# EAGLE schematic testbench (EAGLE 6.6.0)
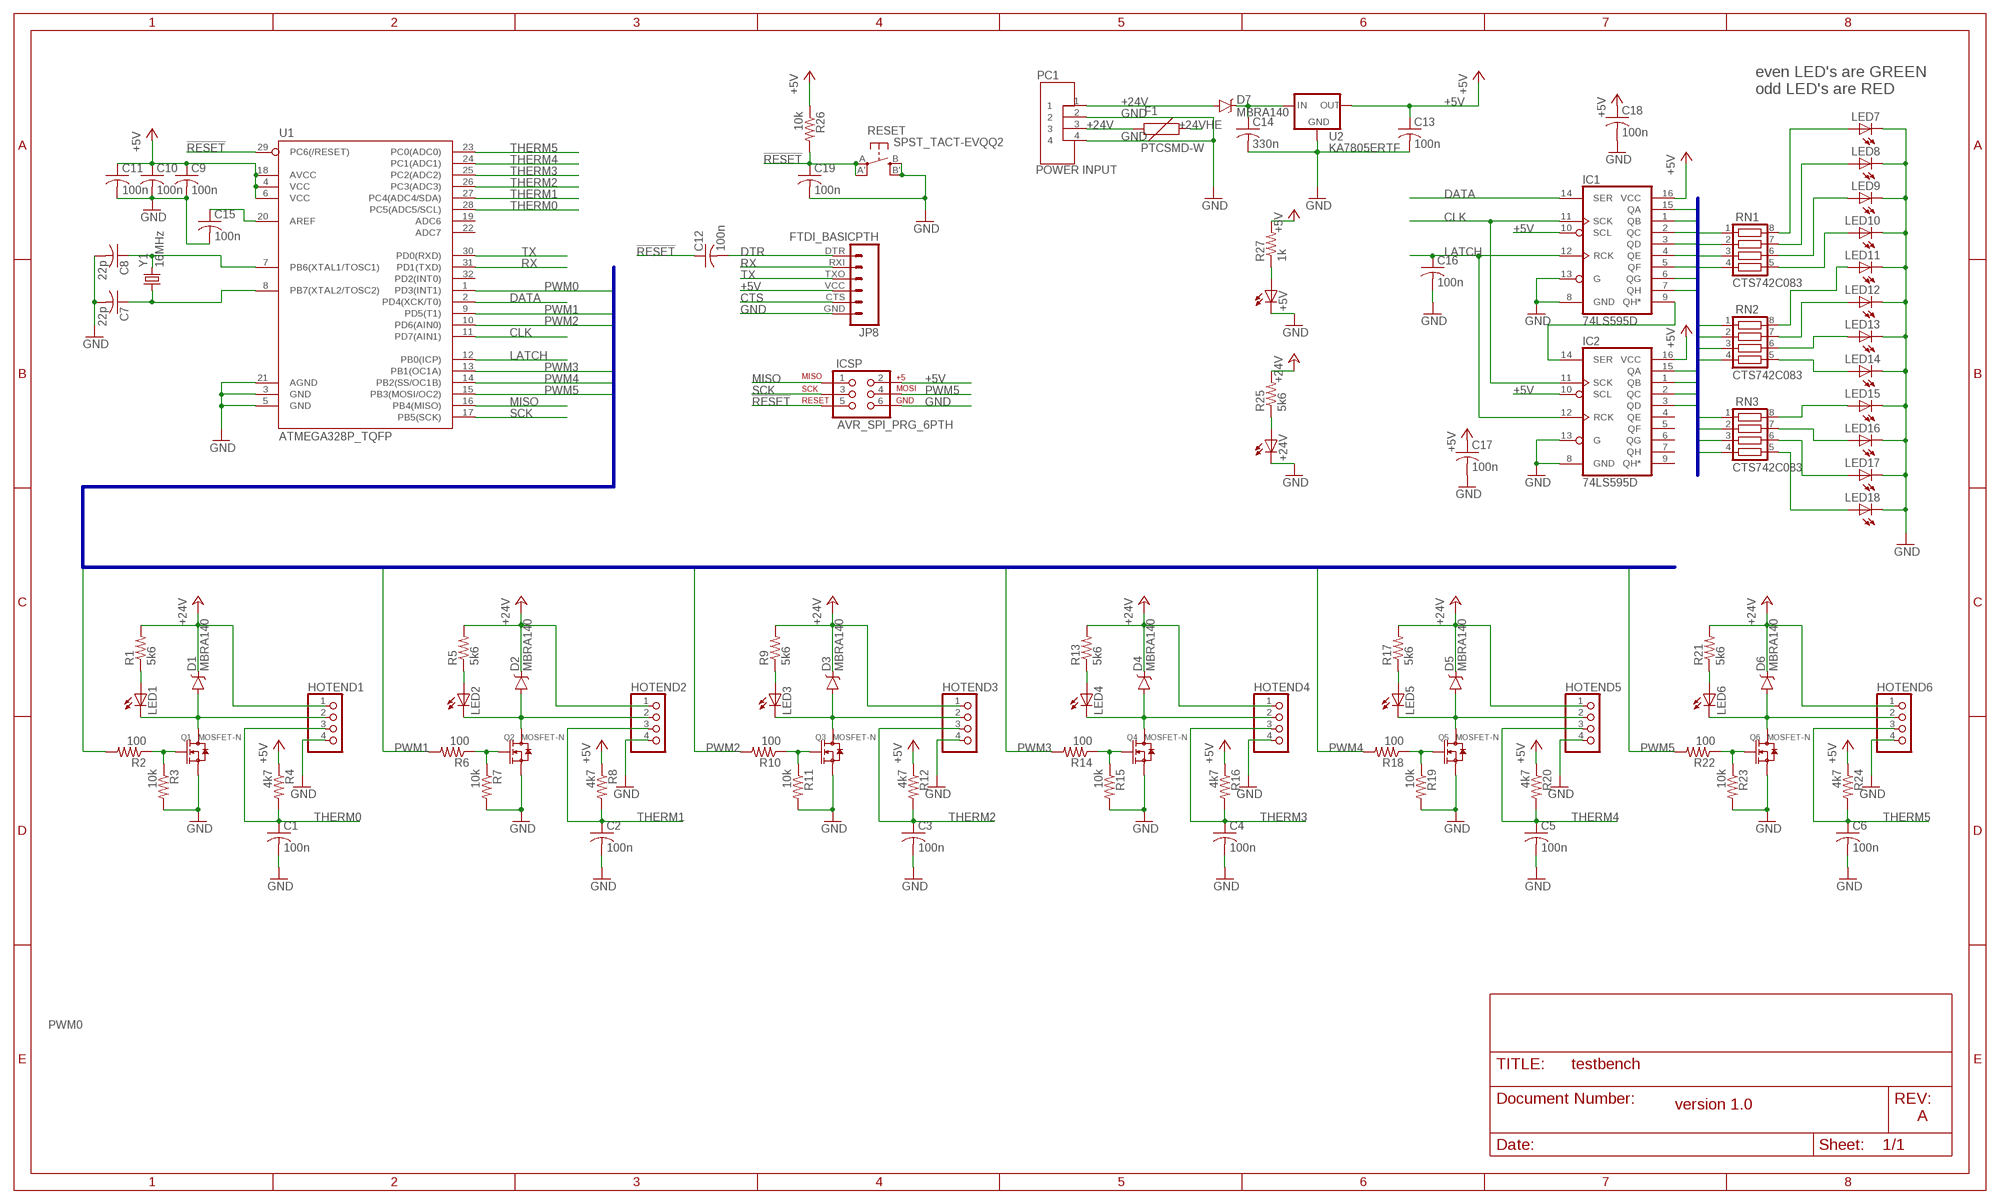
[diagram p0: schematic, sheet 1]

## Parts
+5V  LEDCHIP-LED0805  [CHIP-LED0805]
+24V  LEDCHIP-LED0805  [CHIP-LED0805]
C1  100n  C-USC0805K  [C0805K]
C2  100n  C-USC0805K  [C0805K]
C3  100n  C-USC0805K  [C0805K]
C4  100n  C-USC0805K  [C0805K]
C5  100n  C-USC0805K  [C0805K]
C6  100n  C-USC0805K  [C0805K]
C7  22p  C-USC0805K  [C0805K]
C8  22p  C-USC0805K  [C0805K]
C9  100n  C-USC0805K  [C0805K]
C10  100n  C-USC0805K  [C0805K]
C11  100n  C-USC0805K  [C0805K]
C12  100n  C-USC0805K  [C0805K]
C13  100n  C-USC0805K  [C0805K]
C14  330n  C-USC0805K  [C0805K]
C15  100n  C-USC0805K  [C0805K]
C16  100n  C-USC0805K  [C0805K]
C17  100n  C-USC0805K  [C0805K]
C18  100n  C-USC0805K  [C0805K]
C19  100n  C-USC0805K  [C0805K]
D1  MBRA140  [SMA-DIODE]
D2  MBRA140  [SMA-DIODE]
D3  MBRA140  [SMA-DIODE]
D4  MBRA140  [SMA-DIODE]
D5  MBRA140  [SMA-DIODE]
D6  MBRA140  [SMA-DIODE]
D7  MBRA140  [SMA-DIODE]
F1  PTCSMD-W  [PTC-1206-WIDE]
HOTEND1  PINHD-1X4  [1X04]
HOTEND2  PINHD-1X4  [1X04]
HOTEND3  PINHD-1X4  [1X04]
HOTEND4  PINHD-1X4  [1X04]
HOTEND5  PINHD-1X4  [1X04]
HOTEND6  PINHD-1X4  [1X04]
IC1  74LS595D  [SO16]
IC2  74LS595D  [SO16]
ICSP  AVR_SPI_PRG_6PTH  [2X3]
JP8  FTDI_BASICPTH  [FTDI_BASIC]
LED1  LEDCHIP-LED0805  [CHIP-LED0805]
LED2  LEDCHIP-LED0805  [CHIP-LED0805]
LED3  LEDCHIP-LED0805  [CHIP-LED0805]
LED4  LEDCHIP-LED0805  [CHIP-LED0805]
LED5  LEDCHIP-LED0805  [CHIP-LED0805]
LED6  LEDCHIP-LED0805  [CHIP-LED0805]
LED7  LEDCHIP-LED0805  [CHIP-LED0805]
LED8  LEDCHIP-LED0805  [CHIP-LED0805]
LED9  LEDCHIP-LED0805  [CHIP-LED0805]
LED10  LEDCHIP-LED0805  [CHIP-LED0805]
LED11  LEDCHIP-LED0805  [CHIP-LED0805]
LED12  LEDCHIP-LED0805  [CHIP-LED0805]
LED13  LEDCHIP-LED0805  [CHIP-LED0805]
LED14  LEDCHIP-LED0805  [CHIP-LED0805]
LED15  LEDCHIP-LED0805  [CHIP-LED0805]
LED16  LEDCHIP-LED0805  [CHIP-LED0805]
LED17  LEDCHIP-LED0805  [CHIP-LED0805]
LED18  LEDCHIP-LED0805  [CHIP-LED0805]
PC1  POWER INPUT  POWER_CONNECTOR_4WAY  [MOLEX_MINIFIT-JR]
Q1  MOSFET-N  [SOIC8]
Q2  MOSFET-N  [SOIC8]
Q3  MOSFET-N  [SOIC8]
Q4  MOSFET-N  [SOIC8]
Q5  MOSFET-N  [SOIC8]
Q6  MOSFET-N  [SOIC8]
R1  5k6  R-US_R0805  [R0805]
R2  100  R-US_R0805  [R0805]
R3  10k  R-US_R0805  [R0805]
R4  4k7  R-US_R0805  [R0805]
R5  5k6  R-US_R0805  [R0805]
R6  100  R-US_R0805  [R0805]
R7  10k  R-US_R0805  [R0805]
R8  4k7  R-US_R0805  [R0805]
R9  5k6  R-US_R0805  [R0805]
R10  100  R-US_R0805  [R0805]
R11  10k  R-US_R0805  [R0805]
R12  4k7  R-US_R0805  [R0805]
R13  5k6  R-US_R0805  [R0805]
R14  100  R-US_R0805  [R0805]
R15  10k  R-US_R0805  [R0805]
R16  4k7  R-US_R0805  [R0805]
R17  5k6  R-US_R0805  [R0805]
R18  100  R-US_R0805  [R0805]
R19  10k  R-US_R0805  [R0805]
R20  4k7  R-US_R0805  [R0805]
R21  5k6  R-US_R0805  [R0805]
R22  100  R-US_R0805  [R0805]
R23  10k  R-US_R0805  [R0805]
R24  4k7  R-US_R0805  [R0805]
R25  5k6  R-US_R0805  [R0805]
R26  10k  R-US_R0805  [R0805]
R27  1k  R-US_R0805  [R0805]
RESET  SPST_TACT-EVQQ2  [EVQ-Q2]
RN1  CTS742C083  [CTS742C083]
RN2  CTS742C083  [CTS742C083]
RN3  CTS742C083  [CTS742C083]
U1  ATMEGA328P_TQFP  [TQFP32-08]
U2  KA7805ERTF  V_REG_78XX7812  [TO-252]
Y1  16MHz  CRYSTALHC49US  [HC49US]

## Nets
!RESET: C12.1 C19.1 ICSP.5 R26.2 RESET.A'(P1) RESET.A(P) U1.29(PC6(/RESET))
+5V: C9.1 C10.1 C11.1 C13.1 C17.1 C18.1 IC1.10(SCL) IC1.16(VCC) IC2.10(SCL) IC2.16(VCC) ICSP.2 JP8.VCC R4.1 R8.1 R12.1 R16.1 R20.1 R24.1 R26.1 R27.2 U1.4(VCC) U1.6(VCC) U1.18(AVCC) U2.2(OUT)
+24V: D7.A F1.1 PC1.1 PC1.3 R25.2
+24VHE: D1.C D2.C D3.C D4.C D5.C D6.C F1.2 HOTEND1.1 HOTEND2.1 HOTEND3.1 HOTEND4.1 HOTEND5.1 HOTEND6.1 R1.2 R5.2 R9.2 R13.2 R17.2 R21.2 ; supply symbol labelled +24V
CLK: IC1.11(SCK) IC2.11(SCK) U1.11(PD7(AIN1))
CTS: JP8.CTS
DATA: IC1.14(SER) U1.2(PD4(XCK/T0))
DTR: C12.2 JP8.DTR
GND: +5V.C +24V.C C1.2 C2.2 C3.2 C4.2 C5.2 C6.2 C7.2 C8.2 C9.2 C10.2 C11.2 C13.2 C14.2 C15.2 C16.2 C17.2 C18.2 C19.2 HOTEND1.4 HOTEND2.4 HOTEND3.4 HOTEND4.4 HOTEND5.4 HOTEND6.4 IC1.8(GND) IC1.13(G) IC2.8(GND) IC2.13(G) ICSP.6 JP8.GND LED7.C LED8.C LED9.C LED10.C LED11.C LED12.C LED13.C LED14.C LED15.C LED16.C LED17.C LED18.C PC1.2 PC1.4 Q1.1(S) Q1.2(S) Q1.3(S) Q2.1(S) Q2.2(S) Q2.3(S) Q3.1(S) Q3.2(S) Q3.3(S) Q4.1(S) Q4.2(S) Q4.3(S) Q5.1(S) Q5.2(S) Q5.3(S) Q6.1(S) Q6.2(S) Q6.3(S) R3.2 R7.2 R11.2 R15.2 R19.2 R23.2 RESET.B'(S1) RESET.B(S) U1.3(GND) U1.5(GND) U1.21(AGND) U2.3(GND)
H1: D1.A HOTEND1.2 LED1.C Q1.5(D) Q1.6(D) Q1.7(D) Q1.8(D)
H2: D2.A HOTEND2.2 LED2.C Q2.5(D) Q2.6(D) Q2.7(D) Q2.8(D)
H3: D3.A HOTEND3.2 LED3.C Q3.5(D) Q3.6(D) Q3.7(D) Q3.8(D)
H4: D4.A HOTEND4.2 LED4.C Q4.5(D) Q4.6(D) Q4.7(D) Q4.8(D)
H5: D5.A HOTEND5.2 LED5.C Q5.5(D) Q5.6(D) Q5.7(D) Q5.8(D)
H6: D6.A HOTEND6.2 LED6.C Q6.5(D) Q6.6(D) Q6.7(D) Q6.8(D)
LATCH: C16.1 IC1.12(RCK) IC2.12(RCK) U1.12(PB0(ICP))
LED0: IC1.15(QA) RN2.4
LED1: IC1.1(QB) RN2.3
LED2: IC1.2(QC) RN2.2
LED3: IC1.3(QD) RN2.1
LED4: IC1.4(QE) RN1.4
LED5: IC1.5(QF) RN1.3
LED6: IC1.6(QG) RN1.2
LED7: IC1.7(QH) RN1.1
LED8: IC2.15(QA) RN3.4
LED9: IC2.1(QB) RN3.3
LED10: IC2.2(QC) RN3.2
LED11: IC2.3(QD) RN3.1
MISO: ICSP.1 U1.16(PB4(MISO))
N$1: Q1.4(G) R2.1 R3.1
N$2: +24V.A R25.1
N$3: LED1.A R1.1
N$4: Q5.4(G) R18.1 R19.1
N$5: C7.1 U1.8(PB7(XTAL2/TOSC2)) Y1.1
N$6: LED7.A RN1.8
N$8: Q2.4(G) R6.1 R7.1
N$10: LED2.A R5.1
N$11: Q3.4(G) R10.1 R11.1
N$13: LED3.A R9.1
N$14: Q4.4(G) R14.1 R15.1
N$16: LED4.A R13.1
N$17: LED5.A R17.1
N$18: Q6.4(G) R22.1 R23.1
N$20: LED6.A R21.1
N$21: C8.1 U1.7(PB6(XTAL1/TOSC1)) Y1.2
N$22: C15.1 U1.20(AREF)
N$23: C14.1 D7.C U2.1(IN)
N$24: LED8.A RN1.7
N$25: LED9.A RN1.6
N$26: LED10.A RN1.5
N$27: LED11.A RN2.8
N$28: LED12.A RN2.7
N$29: LED13.A RN2.6
N$30: LED14.A RN2.5
N$31: LED15.A RN3.8
N$32: LED16.A RN3.7
N$33: LED17.A RN3.6
N$34: LED18.A RN3.5
N$35: IC1.9(QH*) IC2.14(SER)
N$36: +5V.A R27.1
PWM0: R2.2 U1.1(PD3(INT1))
PWM1: R6.2 U1.9(PD5(T1))
PWM2: R10.2 U1.10(PD6(AIN0))
PWM3: R14.2 U1.13(PB1(OC1A))
PWM4: R18.2 U1.14(PB2(SS/OC1B))
PWM5: ICSP.4 R22.2 U1.15(PB3(MOSI/OC2))
RX: JP8.RXI U1.31(PD1(TXD))
SCK: ICSP.3 U1.17(PB5(SCK))
THERM0: C1.1 HOTEND1.3 R4.2 U1.28(PC5(ADC5/SCL))
THERM1: C2.1 HOTEND2.3 R8.2 U1.27(PC4(ADC4/SDA))
THERM2: C3.1 HOTEND3.3 R12.2 U1.26(PC3(ADC3))
THERM3: C4.1 HOTEND4.3 R16.2 U1.25(PC2(ADC2))
THERM4: C5.1 HOTEND5.3 R20.2 U1.24(PC1(ADC1))
THERM5: C6.1 HOTEND6.3 R24.2 U1.23(PC0(ADC0))
TX: JP8.TXO U1.30(PD0(RXD))
Unconnected: IC2.4(QE) IC2.5(QF) IC2.6(QG) IC2.7(QH) IC2.9(QH*) U1.19(ADC6) U1.22(ADC7) U1.32(PD2(INT0))

## Buses
PWM[0..5]
LED[0..11]

## Notes on the sheet
- even LED's are GREEN
  odd LED's are RED
- version 1.0
- A

## Library data of the parts
+5V +24V LED1-LED18 = led:LED: LED OSRAM: - CHIPLED LG R971, LG N971, LY N971, LG Q971, LY Q971, LO R971, LY R971 LH N974, LH R974 LS Q976, LO Q976, LY Q976 LO Q996 - Hyper CHIPLED LW Q18S LB Q993, LB Q99A, LB R99A - SideLED LS A670, LO A670, LY A670, LG A670, LP A670 LB A673, LV A673, LT A673, LW A673 LH A674 LY A675 LS A676, LA A676, LO A676, LY A676, LW A676 LS A679, LY A679, LG A679 - Hyper Micro SIDELED® LS Y876, LA Y876, LO Y876, LY Y876 LT Y87S - SmartLED LW L88C, LW L88S LB L89C, LB L89S, LG L890 LS L89K, LO L89K, LY L89K LS L896, LA L896, LO L896, LY L896 - TOPLED LS T670, LO T670, LY T670, LG T670, LP T670 LSG T670, LSP T670, LSY T670, LOP T670, LYG T670 LG T671, LOG T671, LSG T671 LB T673, LV T673, LT T673, LW T673 LH T674 LS T676, LA T676, LO T676, LY T676, LB T676, LH T676, LSB T676, LW T676 LB T67C, LV T67C, LT T67C, LS T67K, LO T67K, LY T67K, LW E67C LS E67B, LA E67B, LO E67B, LY E67B, LB E67C, LV E67C, LT E67C LW T67C LS T679, LY T679, LG T679 LS T770, LO T770, LY T770, LG T770, LP T770 LB T773, LV T773, LT T773, LW T773 LH T774 LS E675, LA E675, LY E675, LS T675 LS T776, LA T776, LO T776, LY T776, LB T776 LHGB T686 LT T68C, LB T68C - Hyper Mini TOPLED® LB M676 - Mini TOPLED Santana® LG M470 LS M47K, LO M47K, LY M47K Source: http://www.osram.convergy.de LUXEON: - LUMILED® LXK2-PW12-R00, LXK2-PW12-S00, LXK2-PW14-U00, LXK2-PW14-V00 LXK2-PM12-R00, LXK2-PM12-S00, LXK2-PM14-U00 LXK2-PE12-Q00, LXK2-PE12-R00, LXK2-PE12-S00, LXK2-PE14-T00, LXK2-PE14-U00 LXK2-PB12-K00, LXK2-PB12-L00, LXK2-PB12-M00, LXK2-PB14-N00, LXK2-PB14-P00, LXK2-PB14-Q00 LXK2-PR12-L00, LXK2-PR12-M00, LXK2-PR14-Q00, LXK2-PR14-R00 LXK2-PD12-Q00, LXK2-PD12-R00, LXK2-PD12-S00 LXK2-PH12-R00, LXK2-PH12-S00 LXK2-PL12-P00, LXK2-PL12-Q00, LXK2-PL12-R00 Source: www.luxeon.com KINGBRIGHT: KA-3528ASYC Source: www.kingbright.com; MF: MULTICOMP; MPN: OVS-0803; OC_FARNELL: 1716765
C1-C6 C9-C13 C15-C19 = rcl:C-US: CAPACITOR, American symbol; MF: AVX; MPN: 08051C104KAT2A; OC_FARNELL: 1740681
C7 C8 = rcl:C-US: CAPACITOR, American symbol; MF: AVX; MPN: 08051A220JAT2A; OC_FARNELL: 317500
C14 = rcl:C-US: CAPACITOR, American symbol; MF: AVX; MPN: 08055C334KAT2A; OC_FARNELL: 1657934
D1-D7 = SparkFun-DiscreteSemi:MBRA140: 40V, 1A Schottky rectifier SMA/DO-214AC package DIO-08053; MF: DIODES INC.; MPN: B140-13-F; OC_FARNELL: 1843670; PROD_ID: DIO-08053
F1 = SparkFun-PowerIC:PTC: Resettable Fuse PTC Resettable Fuse. Spark Fun Electronics SKU : COM-08357; MF: SCHURTER; MPN: 3413.0329.22; OC_FARNELL: 1829472
HOTEND1-HOTEND6 = pinhead:PINHD-1X4: PIN HEADER; OC_FARNELL: unknown
IC1 IC2 = SparkFun-DigitalIC:74*595: 8-bit SHIFT REGISTER, output latch; MF: TEXAS INSTRUMENTS; MPN: SN74AHCT595D; OC_FARNELL: 1740114; PROD_ID: IC-07875
ICSP = SparkFun-Connectors:AVR_SPI_PRG_6: AVR ISP 6 Pin This is the reduced ISP connector for AVR programming. Common on Arduino. This footprint will take up less PCB space and can be used with a 10-pin to 6-pin adapter such as SKU: BOB-08508 **Special note about "TEST_POINT" package. The stop mask is on the top side, so if you want your programming test points to be on the bottom of your board, make sure to place this package on the bottom side of the board. This also ensure that the orientation to program from the bottom side will be correct.; OC_FARNELL: unknown
JP8 = SparkFun-Connectors:FTDI_BASIC: FTDI Basic header with labels; OC_FARNELL: unknown
PC1 = MarcEagleParts:POWER_CONNECTOR_4WAY: MOLEX Mini-Fit Jr. 13A/600V Power connector REF: 39303045 Farnell --> 9963553; MF: MOLEX; MPN: 39303045; OC_FARNELL: 9963553
Q1-Q6 = MarcEagleParts:MOSFET-N: CJ2302：SMD MOSFET N-CH 20V-2.1A; MF: INTERNATIONAL RECTIFIER; MPN: IRF8736PBF; OC_FARNELL: 1551903
R1 R5 R9 R13 R17 R21 R25 = rcl:R-US_: RESISTOR, American symbol; MF: MULTICOMP; MPN: MCWR08X5601FTL; OC_FARNELL: 2447693
R2 R6 R10 R14 R18 R22 = rcl:R-US_: RESISTOR, American symbol; MF: PANASONIC ELECTRONIC COMPONENTS; MPN: ERA6AEB101V; OC_FARNELL: 1577644
R3 R7 R11 R15 R19 R23 R26 = rcl:R-US_: RESISTOR, American symbol; MF: BOURNS; MPN: 0621-013K500-AB103; OC_FARNELL: 2469474
R4 R8 R12 R16 R20 R24 = rcl:R-US_: RESISTOR, American symbol; MF: TE CONNECTIVITY; MPN: 1-2176085-7; OC_FARNELL: 2118118
R27 = rcl:R-US_: RESISTOR, American symbol; MF: BOURNS; MPN: CR0805-JW-102ELF; OC_FARNELL: 2008389
RESET = adafruit:SPST_TACT: SMT 6mm switch, EVQQ2 series http://www.ladyada.net/library/eagle; MF: PANASONIC ELECTRONIC COMPONENTS; MPN: EVQQ2503W; OC_FARNELL: 9962913
RN1-RN3 = resistor-net:CTS742C083: Chip Resistor Array 4 Single Resistor Source: http://www.ctscorp.com/components/Datasheets/CTSChipArrayDs.pdf; OC_FARNELL: unknown; OC_NEWARK: unknown
U1 = SparkFun-DigitalIC:ATMEGA328P_TQFP; MF: ATMEL; MPN: ATMEGA328-AU; OC_FARNELL: 1972086; PROD_ID: IC-09069
U2 = SparkFun-PowerIC:V_REG_78XX: Voltage Regulator Standard 78xx regulator. IGO (Input Ground Output). Spark Fun Electronics SKU : COM-00107; MF: FAIRCHILD SEMICONDUCTOR; MPN: KA7805ERTF; OC_FARNELL: 2102585; PROD_ID: VREG-12370; VALUE: +12v
Y1 = SparkFun-FreqCtrl:CRYSTAL: Various standard crystals. Proven footprints.; MF: TXC; MPN: 9B-20.000MAAJ-B; OC_FARNELL: 1842224